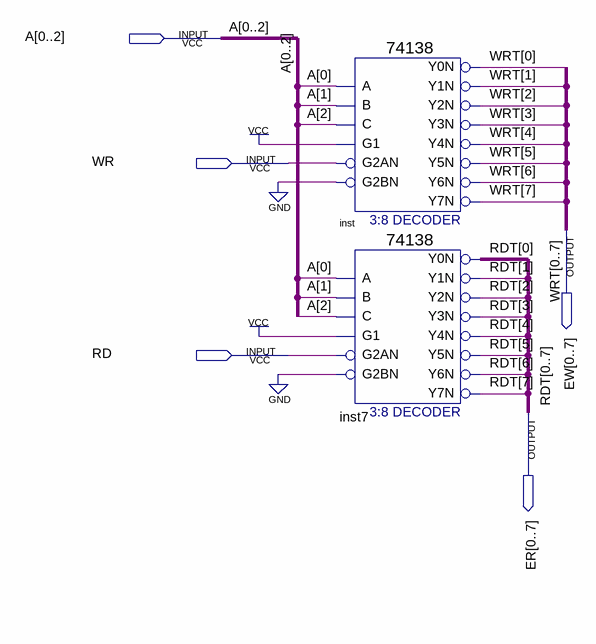
[diagram p0: schematic sheet]
// Quartus schematic Decoder38.bdf as structural Verilog: 2 symbols, 5 pins
module Decoder38 (
  input  [0:2] A,
  input  WR,
  input  RD,
  output [0:7] EW,
  output [0:7] ER
);

  \74138  inst (
    .A(A[0]), .B(A[1]), .G1(1'b1), .C(A[2]), .G2AN(WR), .G2BN(1'b0), .Y0N(EW[0]), .Y1N(EW[1]), .Y2N(EW[2]),
    .Y3N(EW[3]), .Y4N(EW[4]), .Y5N(EW[5]), .Y6N(EW[6]), .Y7N(EW[7]));
  \74138  inst7 (
    .A(A[0]), .B(A[1]), .G1(1'b1), .C(A[2]), .G2AN(RD), .G2BN(1'b0), .Y0N(ER[0]), .Y1N(ER[1]), .Y2N(ER[2]),
    .Y3N(ER[3]), .Y4N(ER[4]), .Y5N(ER[5]), .Y6N(ER[6]), .Y7N(ER[7]));

  // Other names for the same wires on the sheet: RDT[7:0] = {ER[7], ER[6], ER[5], ER[4], ER[3], ER[2], ER[1], ER[0]};
  //   WRT[7:0] = {EW[7], EW[6], EW[5], EW[4], EW[3], EW[2], EW[1], EW[0]}
endmodule
